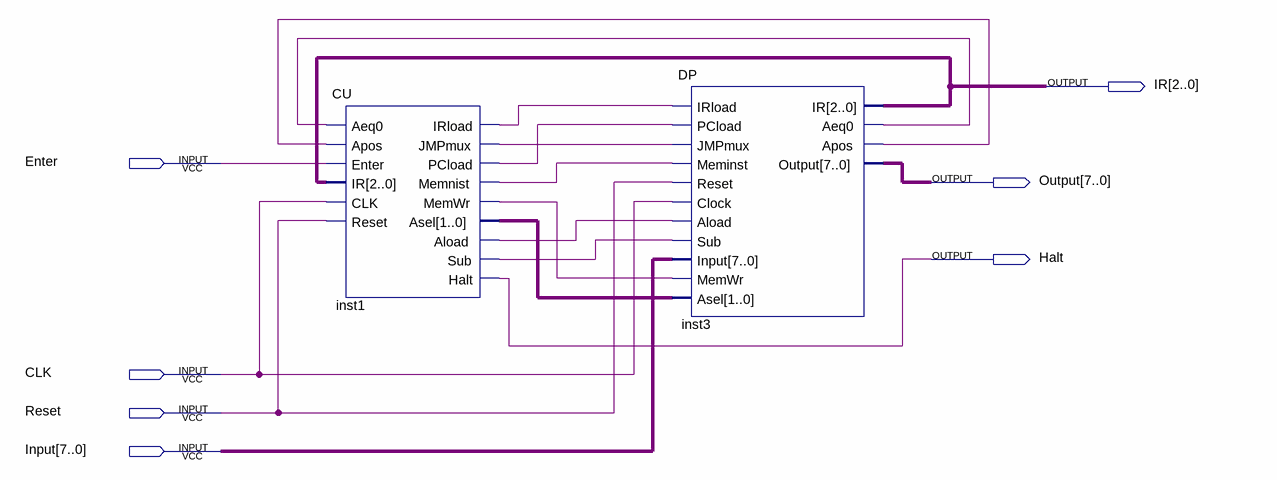
[diagram p0: schematic sheet]
// Quartus schematic IC_2.bdf as structural Verilog: 2 symbols, 7 pins
module IC_2 (
  input  Enter,
  input  CLK,
  input  Reset,
  input  [7:0] Input,
  output [2:0] IR,
  output [7:0] Output,
  output Halt
);

  wire inst1_aload, inst1_irload, inst1_jmpmux, inst1_memnist, inst1_memwr, inst1_pcload, inst1_sub,
       inst3_aeq0, inst3_apos;
  wire [1:0] inst1_asel;

  CU inst1 (
    .Aeq0(inst3_aeq0), .Apos(inst3_apos), .Enter(Enter), .IR(IR), .CLK(CLK), .Reset(Reset),
    .IRload(inst1_irload), .JMPmux(inst1_jmpmux), .PCload(inst1_pcload), .Memnist(inst1_memnist),
    .MemWr(inst1_memwr), .Asel(inst1_asel), .Aload(inst1_aload), .Sub(inst1_sub), .Halt(Halt));
  DP inst3 (
    .IRload(inst1_irload), .PCload(inst1_pcload), .JMPmux(inst1_jmpmux), .Meminst(inst1_memnist),
    .Reset(Reset), .Clock(CLK), .Aload(inst1_aload), .Sub(inst1_sub), .Input(Input), .MemWr(inst1_memwr),
    .Asel(inst1_asel), .IR(IR), .Aeq0(inst3_aeq0), .Apos(inst3_apos), .Output(Output));
endmodule
